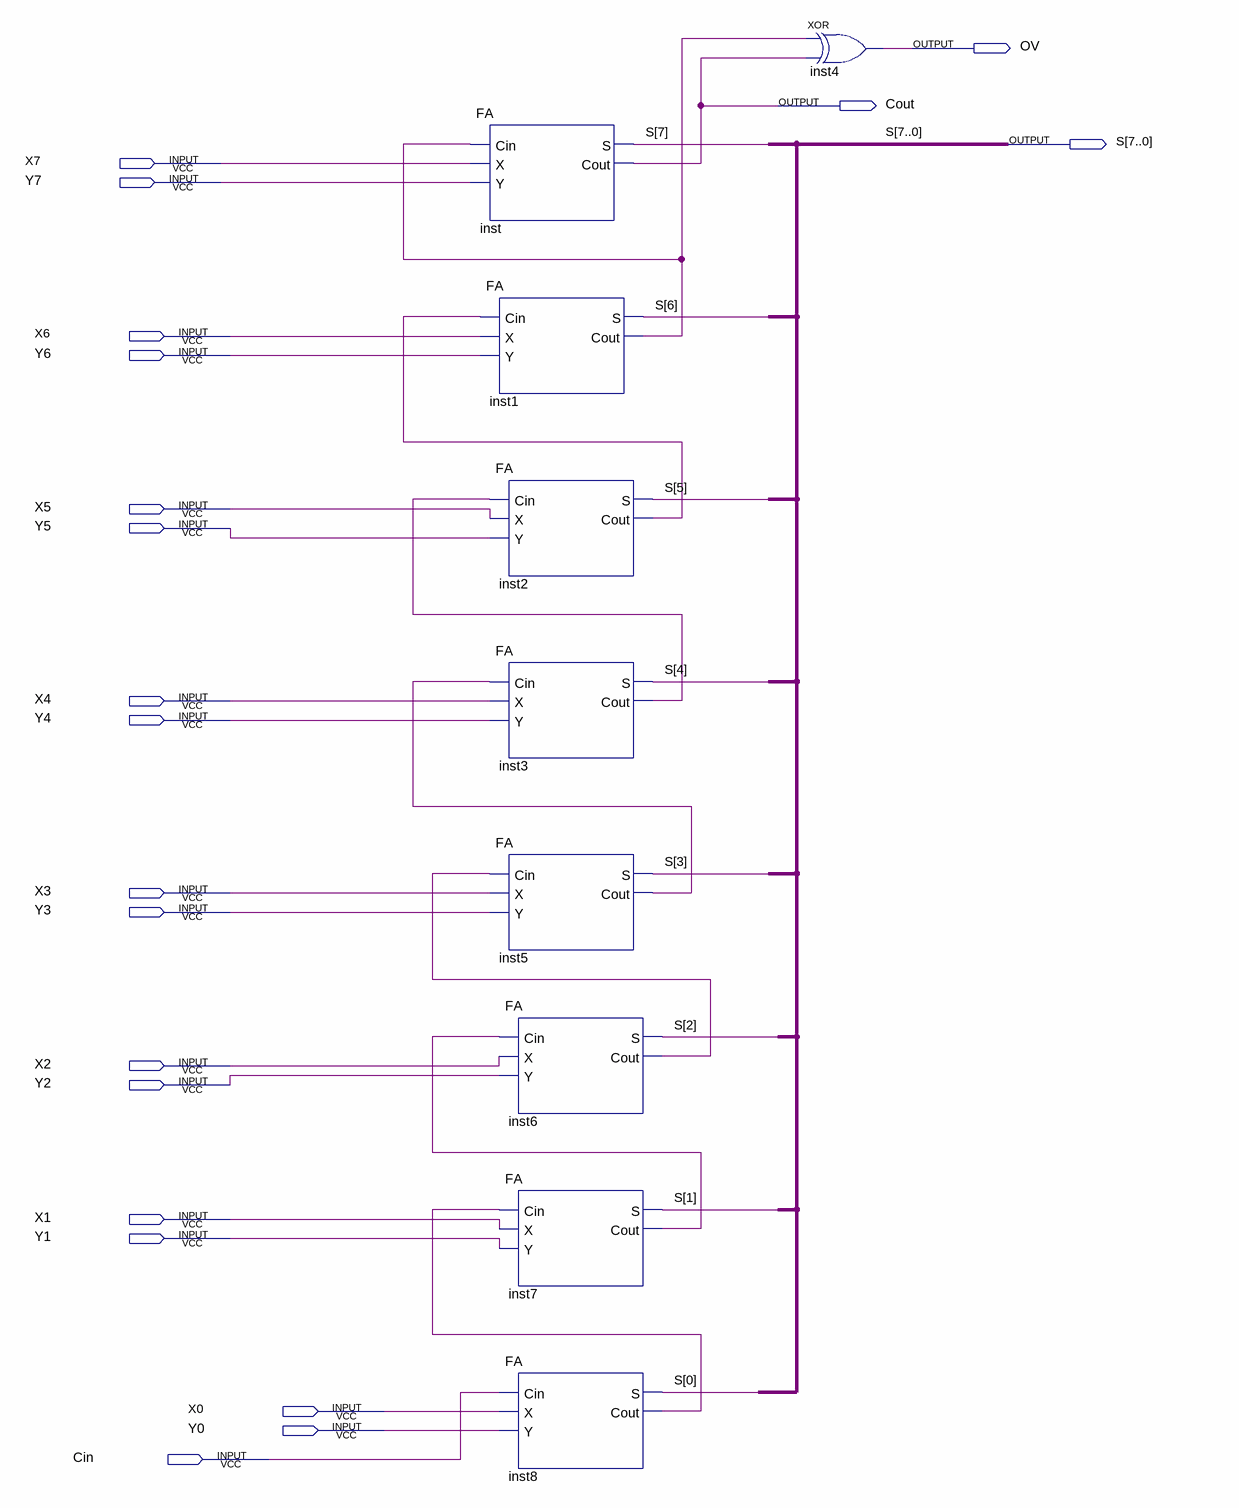
[diagram p0: schematic sheet]
// Quartus schematic 8bit_adder.bdf as structural Verilog: 9 symbols, 20 pins
module \8bit_adder  (
  input  X7,
  input  Y7,
  input  X6,
  input  Y6,
  input  X5,
  input  Y5,
  input  X4,
  input  Y4,
  input  X3,
  input  Y3,
  input  X2,
  input  Y2,
  input  X1,
  input  Y1,
  input  X0,
  input  Y0,
  input  Cin,
  output OV,
  output Cout,
  output [7:0] S
);

  wire inst1_cout, inst2_cout, inst3_cout, inst5_cout, inst6_cout, inst7_cout, inst8_cout;

  FA inst (.Cin(inst1_cout), .X(X7), .Y(Y7), .S(S[7]), .Cout(Cout));
  FA inst1 (.Cin(inst2_cout), .X(X6), .Y(Y6), .S(S[6]), .Cout(inst1_cout));
  FA inst2 (.Cin(inst3_cout), .X(X5), .Y(Y5), .S(S[5]), .Cout(inst2_cout));
  FA inst3 (.Cin(inst5_cout), .X(X4), .Y(Y4), .S(S[4]), .Cout(inst3_cout));
  FA inst5 (.Cin(inst6_cout), .X(X3), .Y(Y3), .S(S[3]), .Cout(inst5_cout));
  FA inst6 (.Cin(inst7_cout), .X(X2), .Y(Y2), .S(S[2]), .Cout(inst6_cout));
  FA inst7 (.Cin(inst8_cout), .X(X1), .Y(Y1), .S(S[1]), .Cout(inst7_cout));
  FA inst8 (.Cin(Cin), .X(X0), .Y(Y0), .S(S[0]), .Cout(inst8_cout));
  xor inst4 (OV, inst1_cout, Cout);
endmodule
